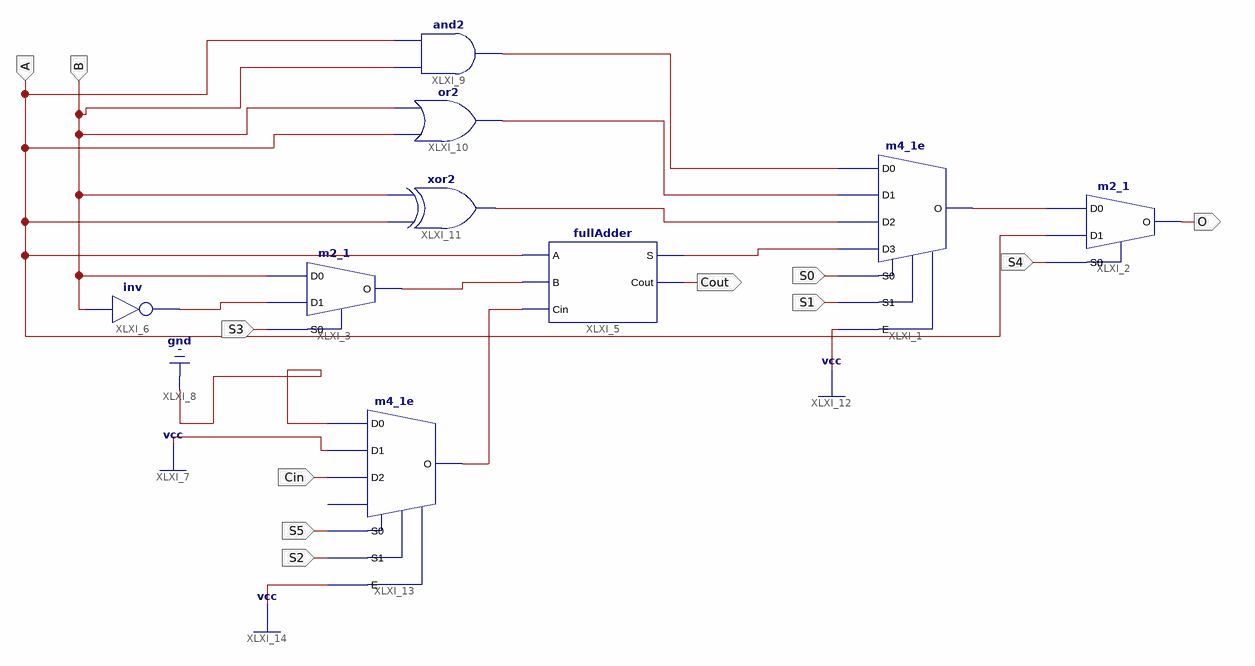
[diagram p0: schematic sheet 1]
// Xilinx ISE schematic ALU.sch (spartan3e) as structural Verilog: 9 symbols, 11 ports
module ALU (
  input  A,
  input  B,
  input  S4,
  input  S0,
  input  S1,
  input  S3,
  input  Cin,
  input  S5,
  input  S2,
  output O,
  output Cout
);

  wire XLXN_3, XLXN_4, XLXN_7, XLXN_13, XLXN_14, XLXN_15, XLXN_16, XLXN_17;

  m4_1e XLXI_1 (.D0(XLXN_13), .D1(XLXN_14), .D2(XLXN_15), .D3(XLXN_16), .E(1'b1), .S0(S0), .S1(S1), .O(XLXN_17));
  m2_1 XLXI_2 (.D0(XLXN_17), .D1(A), .S0(S4), .O(O));
  m2_1 XLXI_3 (.D0(B), .D1(XLXN_7), .S0(S3), .O(XLXN_3));
  fullAdder XLXI_5 (.A(A), .B(XLXN_3), .Cin(XLXN_4), .S(XLXN_16), .Cout(Cout));
  not XLXI_6 (XLXN_7, B);
  and XLXI_9 (XLXN_13, B, A);
  or XLXI_10 (XLXN_14, A, B);
  xor XLXI_11 (XLXN_15, A, B);
  m4_1e XLXI_13 (.D0(1'b0), .D1(1'b1), .D2(Cin), .E(1'b1), .S0(S5), .S1(S2), .O(XLXN_4));  // open: D3
endmodule
